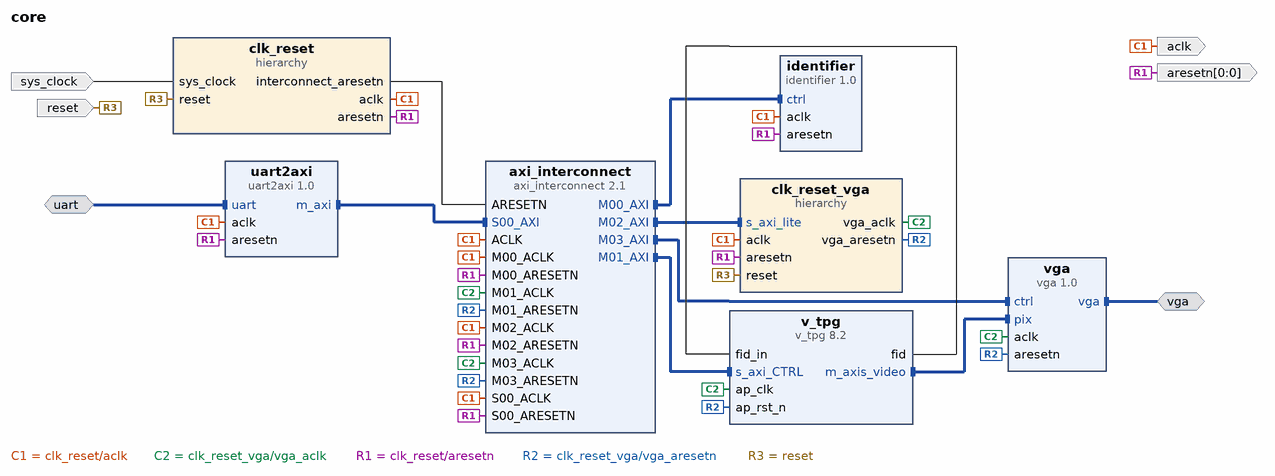
[diagram p0: block diagram of the top level]
# Vivado block design core, xc7a35ticsg324-1L, Vivado 2022.2
create_bd_design core

create_bd_intf_port -mode Master -vlnv xilinx.com:interface:vga_rtl:1.0 vga
create_bd_intf_port -mode MirroredMaster -vlnv xilinx.com:interface:uart_rtl:1.0 uart
create_bd_port -dir O -type clk aclk
create_bd_port -dir O -from 0 -to 0 -type rst aresetn
create_bd_port -dir I -type clk sys_clock
set_property -dict {CONFIG.FREQ_HZ 100000000 CONFIG.PHASE 0.0} [get_bd_ports sys_clock]
create_bd_port -dir I -type rst reset
set_property -dict {CONFIG.POLARITY ACTIVE_LOW} [get_bd_ports reset]

create_bd_cell -type ip -vlnv xilinx.com:ip:v_tpg:8.2 v_tpg
set_property -dict {CONFIG.SAMPLES_PER_CLOCK 1} [get_bd_cells v_tpg]
create_bd_cell -type ip -vlnv xilinx.com:ip:axi_interconnect:2.1 axi_interconnect
set_property -dict {CONFIG.NUM_MI 4} [get_bd_cells axi_interconnect]
create_bd_cell -type ip -vlnv lvin:interfaces:uart2axi:1.0 uart2axi
set_property -dict {CONFIG.BAUD_RATE 1000000} [get_bd_cells uart2axi]
create_bd_cell -type ip -vlnv lvin:versioning:identifier:1.0 identifier
set_property -dict {CONFIG.NAME {VGA Demo}} [get_bd_cells identifier]
create_bd_cell -type hier clk_reset
create_bd_cell -type hier clk_reset_vga
create_bd_cell -type ip -vlnv lvin:interfaces:vga:1.0 vga

# ---- hierarchy /clk_reset ----
current_bd_instance /clk_reset
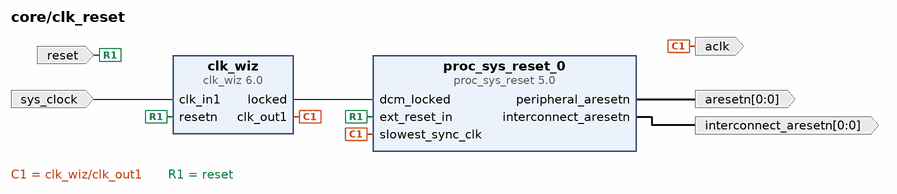
[diagram p1: block diagram inside /clk_reset]
create_bd_pin -dir O -type clk aclk
create_bd_pin -dir O -from 0 -to 0 -type rst interconnect_aresetn
create_bd_pin -dir O -from 0 -to 0 -type rst aresetn
create_bd_pin -dir I -type clk sys_clock
create_bd_pin -dir I -type rst reset

create_bd_cell -type ip -vlnv xilinx.com:ip:clk_wiz:6.0 clk_wiz
set_property -dict [list \
  CONFIG.CLKOUT1_JITTER 130.958 \
  CONFIG.CLKOUT1_REQUESTED_OUT_FREQ 100 \
  CONFIG.CLK_IN1_BOARD_INTERFACE sys_clock \
  CONFIG.MMCM_CLKOUT0_DIVIDE_F 10.000 \
  CONFIG.RESET_BOARD_INTERFACE reset \
  CONFIG.RESET_PORT resetn \
  CONFIG.RESET_TYPE ACTIVE_LOW \
  CONFIG.USE_BOARD_FLOW true \
  CONFIG.USE_RESET true \
] [get_bd_cells clk_wiz]
create_bd_cell -type ip -vlnv xilinx.com:ip:proc_sys_reset:5.0 proc_sys_reset_0
set_property -dict {CONFIG.RESET_BOARD_INTERFACE Custom CONFIG.USE_BOARD_FLOW true} [get_bd_cells proc_sys_reset_0]

# ---- hierarchy /clk_reset_vga ----
current_bd_instance /clk_reset_vga
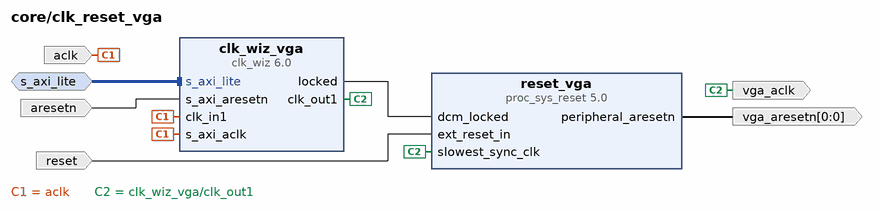
[diagram p2: block diagram inside /clk_reset_vga]
create_bd_intf_pin -mode Slave -vlnv xilinx.com:interface:aximm_rtl:1.0 s_axi_lite
create_bd_pin -dir I -type clk aclk
create_bd_pin -dir I -type rst aresetn
create_bd_pin -dir O -type clk vga_aclk
create_bd_pin -dir I -type rst reset
create_bd_pin -dir O -from 0 -to 0 -type rst vga_aresetn

create_bd_cell -type ip -vlnv xilinx.com:ip:clk_wiz:6.0 clk_wiz_vga
set_property -dict [list \
  CONFIG.CLKOUT1_JITTER 159.371 \
  CONFIG.CLKOUT1_REQUESTED_OUT_FREQ 40 \
  CONFIG.MMCM_CLKOUT0_DIVIDE_F 25.000 \
  CONFIG.PRIM_SOURCE Global_buffer \
  CONFIG.USE_DYN_RECONFIG true \
] [get_bd_cells clk_wiz_vga]
create_bd_cell -type ip -vlnv xilinx.com:ip:proc_sys_reset:5.0 reset_vga

# ---- connections ----

current_bd_instance /clk_reset
connect_bd_net -net clk_wiz_0_clk_out1 [get_bd_pins clk_wiz/clk_out1] [get_bd_pins aclk] [get_bd_pins proc_sys_reset_0/slowest_sync_clk]
connect_bd_net -net clk_wiz_0_locked [get_bd_pins clk_wiz/locked] [get_bd_pins proc_sys_reset_0/dcm_locked]
connect_bd_net [get_bd_pins proc_sys_reset_0/interconnect_aresetn] [get_bd_pins interconnect_aresetn]
connect_bd_net [get_bd_pins proc_sys_reset_0/peripheral_aresetn] [get_bd_pins aresetn]
connect_bd_net -net reset2_1 [get_bd_pins reset] [get_bd_pins clk_wiz/resetn] [get_bd_pins proc_sys_reset_0/ext_reset_in]
connect_bd_net -net sys_clock_0_1 [get_bd_pins sys_clock] [get_bd_pins clk_wiz/clk_in1]

current_bd_instance /clk_reset_vga
connect_bd_intf_net -intf_net axi_interconnect_M02_AXI [get_bd_intf_pins s_axi_lite] [get_bd_intf_pins clk_wiz_vga/s_axi_lite]
connect_bd_net -net clk_wiz_0_clk_out1 [get_bd_pins aclk] [get_bd_pins clk_wiz_vga/clk_in1] [get_bd_pins clk_wiz_vga/s_axi_aclk]
connect_bd_net -net clk_wiz_0_clk_out2 [get_bd_pins clk_wiz_vga/clk_out1] [get_bd_pins vga_aclk] [get_bd_pins reset_vga/slowest_sync_clk]
connect_bd_net -net clk_wiz_0_locked [get_bd_pins clk_wiz_vga/locked] [get_bd_pins reset_vga/dcm_locked]
connect_bd_net -net ext_reset_in_0_1 [get_bd_pins reset] [get_bd_pins reset_vga/ext_reset_in]
connect_bd_net -net proc_sys_reset_0_peripheral_aresetn [get_bd_pins aresetn] [get_bd_pins clk_wiz_vga/s_axi_aresetn]
connect_bd_net -net proc_sys_reset_0_peripheral_aresetn1 [get_bd_pins reset_vga/peripheral_aresetn] [get_bd_pins vga_aresetn]

current_bd_instance /
connect_bd_intf_net [get_bd_intf_ports uart] [get_bd_intf_pins uart2axi/uart]
connect_bd_intf_net [get_bd_intf_pins axi_interconnect/M00_AXI] [get_bd_intf_pins identifier/ctrl]
connect_bd_intf_net [get_bd_intf_pins axi_interconnect/M01_AXI] [get_bd_intf_pins v_tpg/s_axi_CTRL]
connect_bd_intf_net [get_bd_intf_pins axi_interconnect/M02_AXI] [get_bd_intf_pins clk_reset_vga/s_axi_lite]
connect_bd_intf_net [get_bd_intf_pins vga/ctrl] [get_bd_intf_pins axi_interconnect/M03_AXI]
connect_bd_intf_net [get_bd_intf_pins uart2axi/m_axi] [get_bd_intf_pins axi_interconnect/S00_AXI]
connect_bd_intf_net [get_bd_intf_pins v_tpg/m_axis_video] [get_bd_intf_pins vga/pix]
connect_bd_intf_net [get_bd_intf_ports vga] [get_bd_intf_pins vga/vga]
connect_bd_net -net clk_wiz_0_clk_out1 [get_bd_pins clk_reset/aclk] \
  [get_bd_ports aclk] [get_bd_pins uart2axi/aclk] [get_bd_pins identifier/aclk] [get_bd_pins axi_interconnect/ACLK] \
  [get_bd_pins axi_interconnect/S00_ACLK] [get_bd_pins axi_interconnect/M00_ACLK] [get_bd_pins axi_interconnect/M02_ACLK] \
  [get_bd_pins clk_reset_vga/aclk]
connect_bd_net -net clk_wiz_0_clk_out2 [get_bd_pins clk_reset_vga/vga_aclk] \
  [get_bd_pins v_tpg/ap_clk] [get_bd_pins vga/aclk] [get_bd_pins axi_interconnect/M03_ACLK] \
  [get_bd_pins axi_interconnect/M01_ACLK]
connect_bd_net -net proc_sys_reset_0_interconnect_aresetn [get_bd_pins clk_reset/interconnect_aresetn] [get_bd_pins axi_interconnect/ARESETN]
connect_bd_net -net proc_sys_reset_0_peripheral_aresetn [get_bd_pins clk_reset/aresetn] \
  [get_bd_ports aresetn] [get_bd_pins uart2axi/aresetn] [get_bd_pins identifier/aresetn] \
  [get_bd_pins axi_interconnect/M00_ARESETN] [get_bd_pins axi_interconnect/S00_ARESETN] \
  [get_bd_pins axi_interconnect/M02_ARESETN] [get_bd_pins clk_reset_vga/aresetn]
connect_bd_net -net proc_sys_reset_0_peripheral_aresetn1 [get_bd_pins clk_reset_vga/vga_aresetn] \
  [get_bd_pins v_tpg/ap_rst_n] [get_bd_pins vga/aresetn] [get_bd_pins axi_interconnect/M03_ARESETN] \
  [get_bd_pins axi_interconnect/M01_ARESETN]
connect_bd_net [get_bd_ports reset] [get_bd_pins clk_reset/reset] [get_bd_pins clk_reset_vga/reset]
connect_bd_net -net sys_clock_0_1 [get_bd_ports sys_clock] [get_bd_pins clk_reset/sys_clock]
connect_bd_net [get_bd_pins v_tpg/fid] [get_bd_pins v_tpg/fid_in]

# ---- address map ----
assign_bd_address -offset 0x40000000 -range 4K -target_address_space [get_bd_addr_spaces uart2axi/m_axi] [get_bd_addr_segs identifier/ctrl/reg0]
assign_bd_address -offset 0x40001000 -range 4K -target_address_space [get_bd_addr_spaces uart2axi/m_axi] [get_bd_addr_segs vga/ctrl/reg0]
assign_bd_address -offset 0x40002000 -range 4K -target_address_space [get_bd_addr_spaces uart2axi/m_axi] [get_bd_addr_segs clk_reset_vga/clk_wiz_vga/s_axi_lite/Reg]
assign_bd_address -offset 0x40003000 -range 4K -target_address_space [get_bd_addr_spaces uart2axi/m_axi] [get_bd_addr_segs v_tpg/s_axi_CTRL/Reg]

validate_bd_design
save_bd_design
